# EAGLE design Xadow Audio v1.0 (EAGLE 6.4)
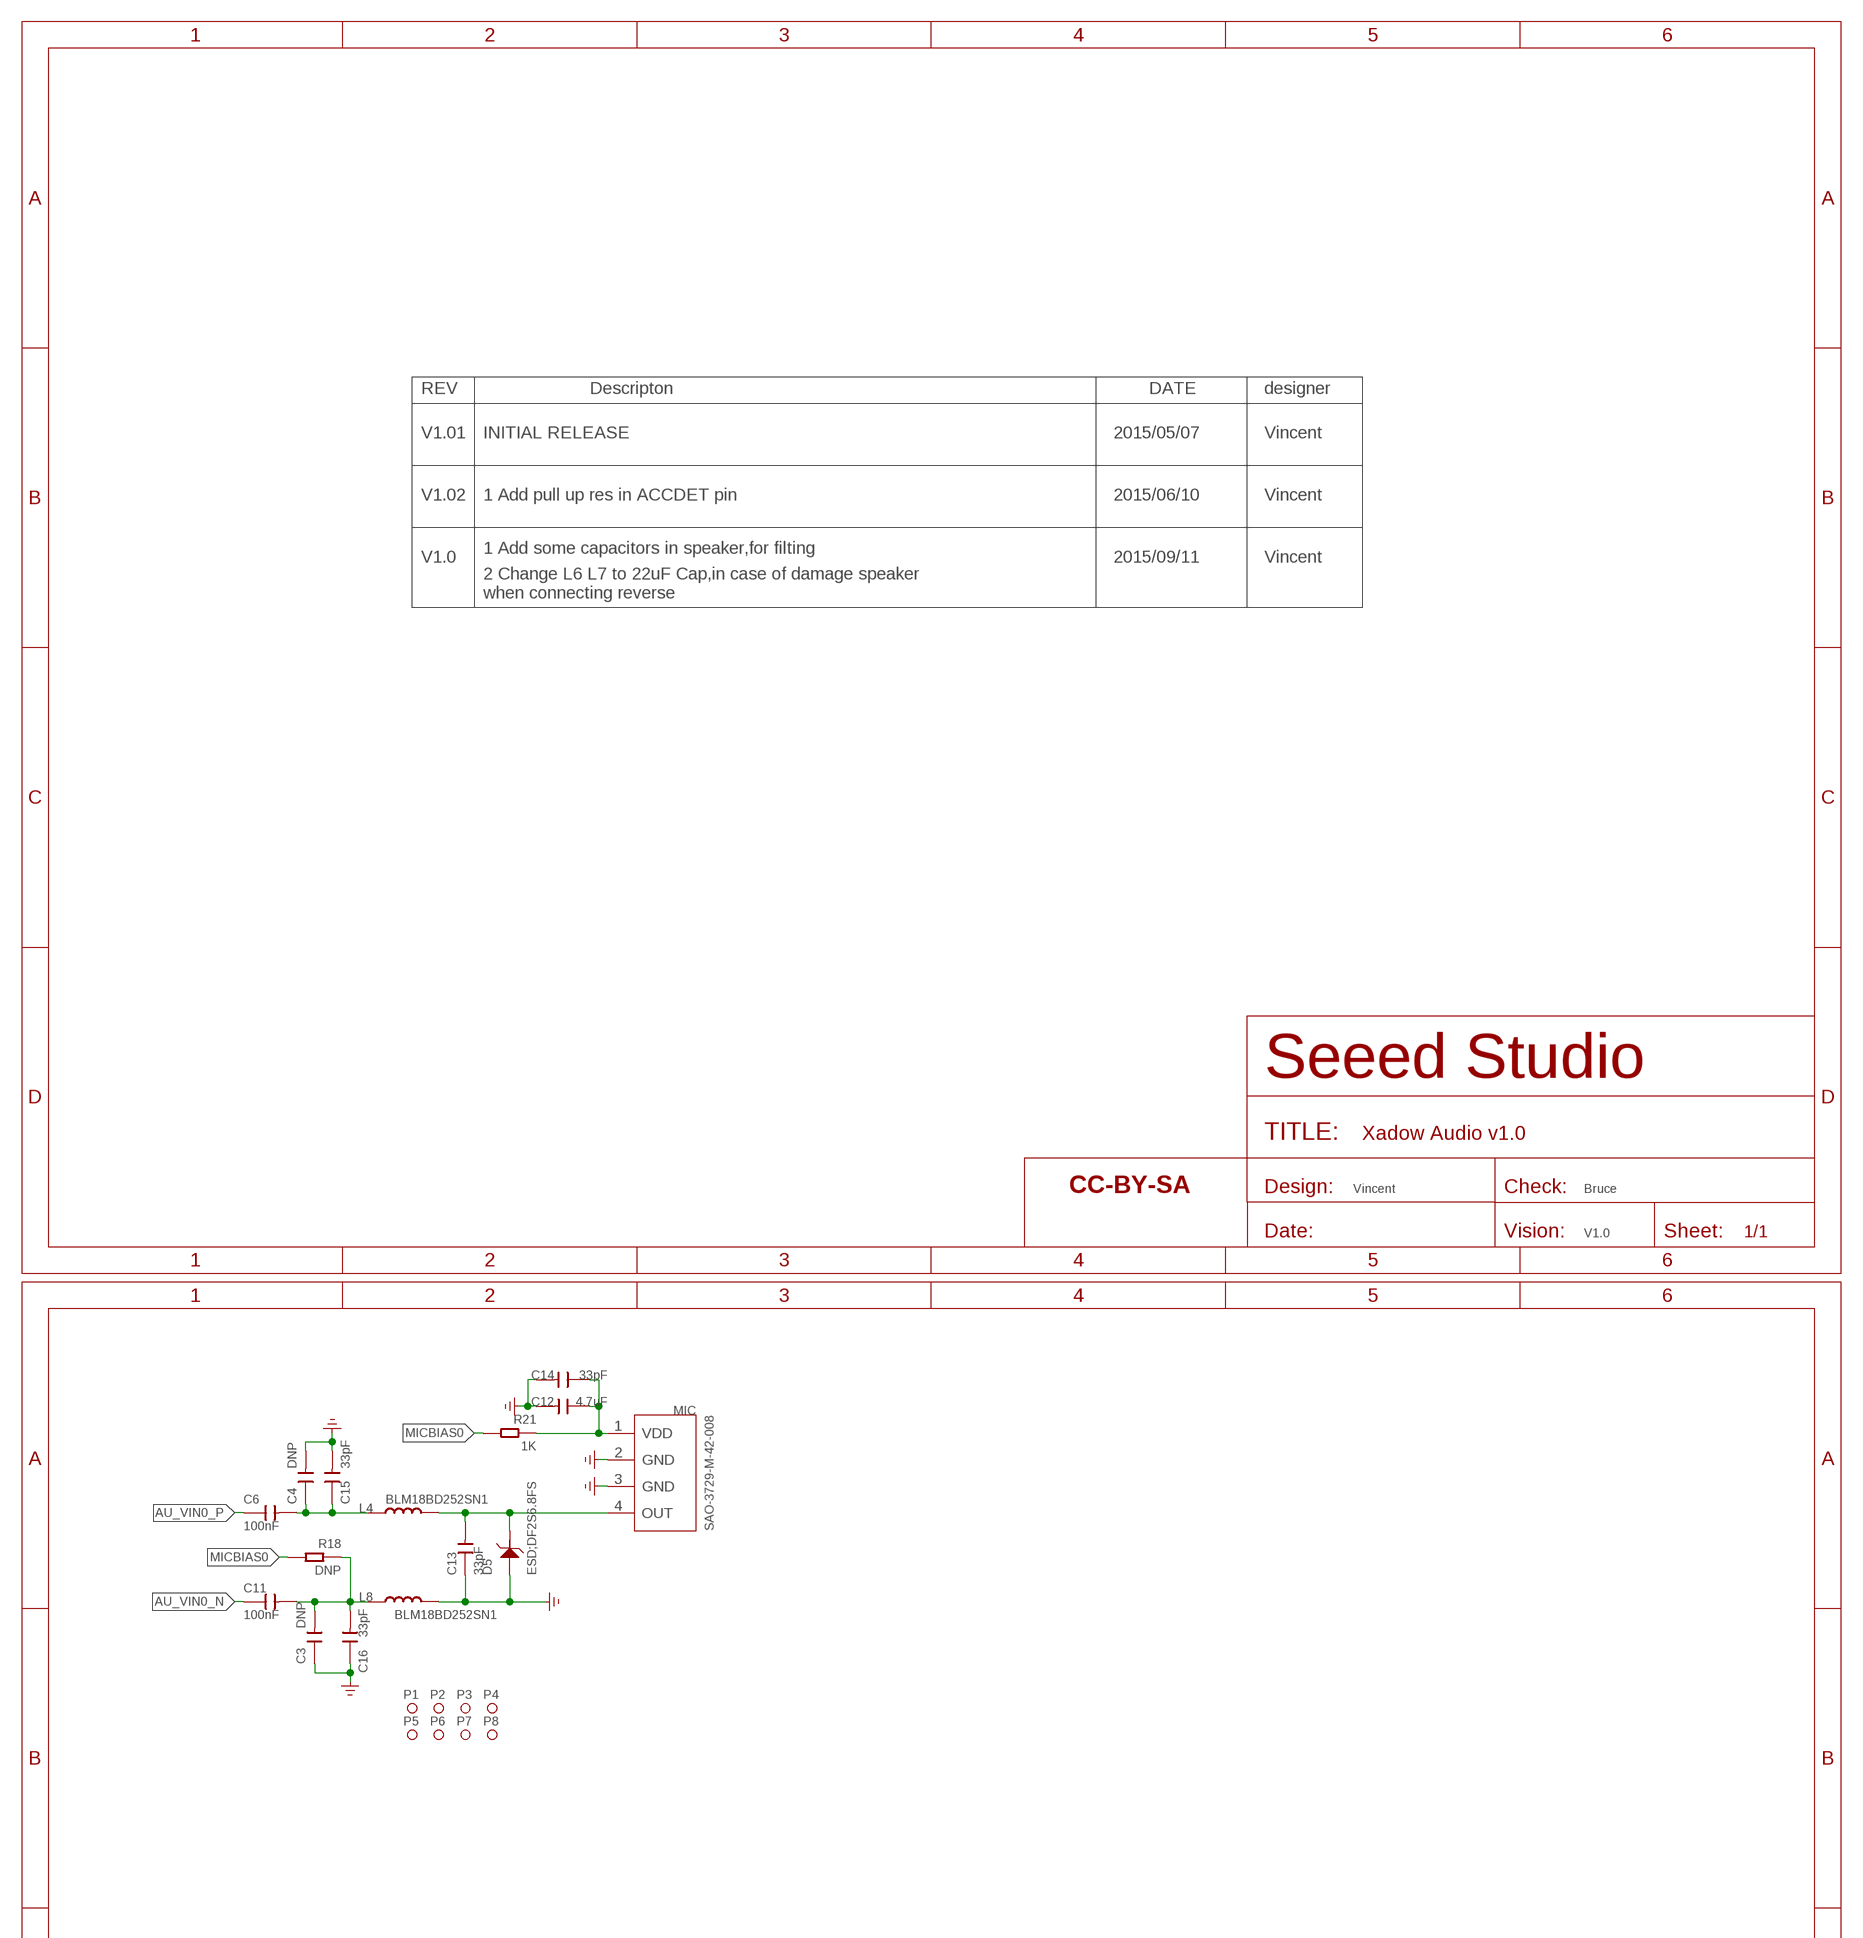
[diagram p0: schematic, sheet 1, part 1 of 2]
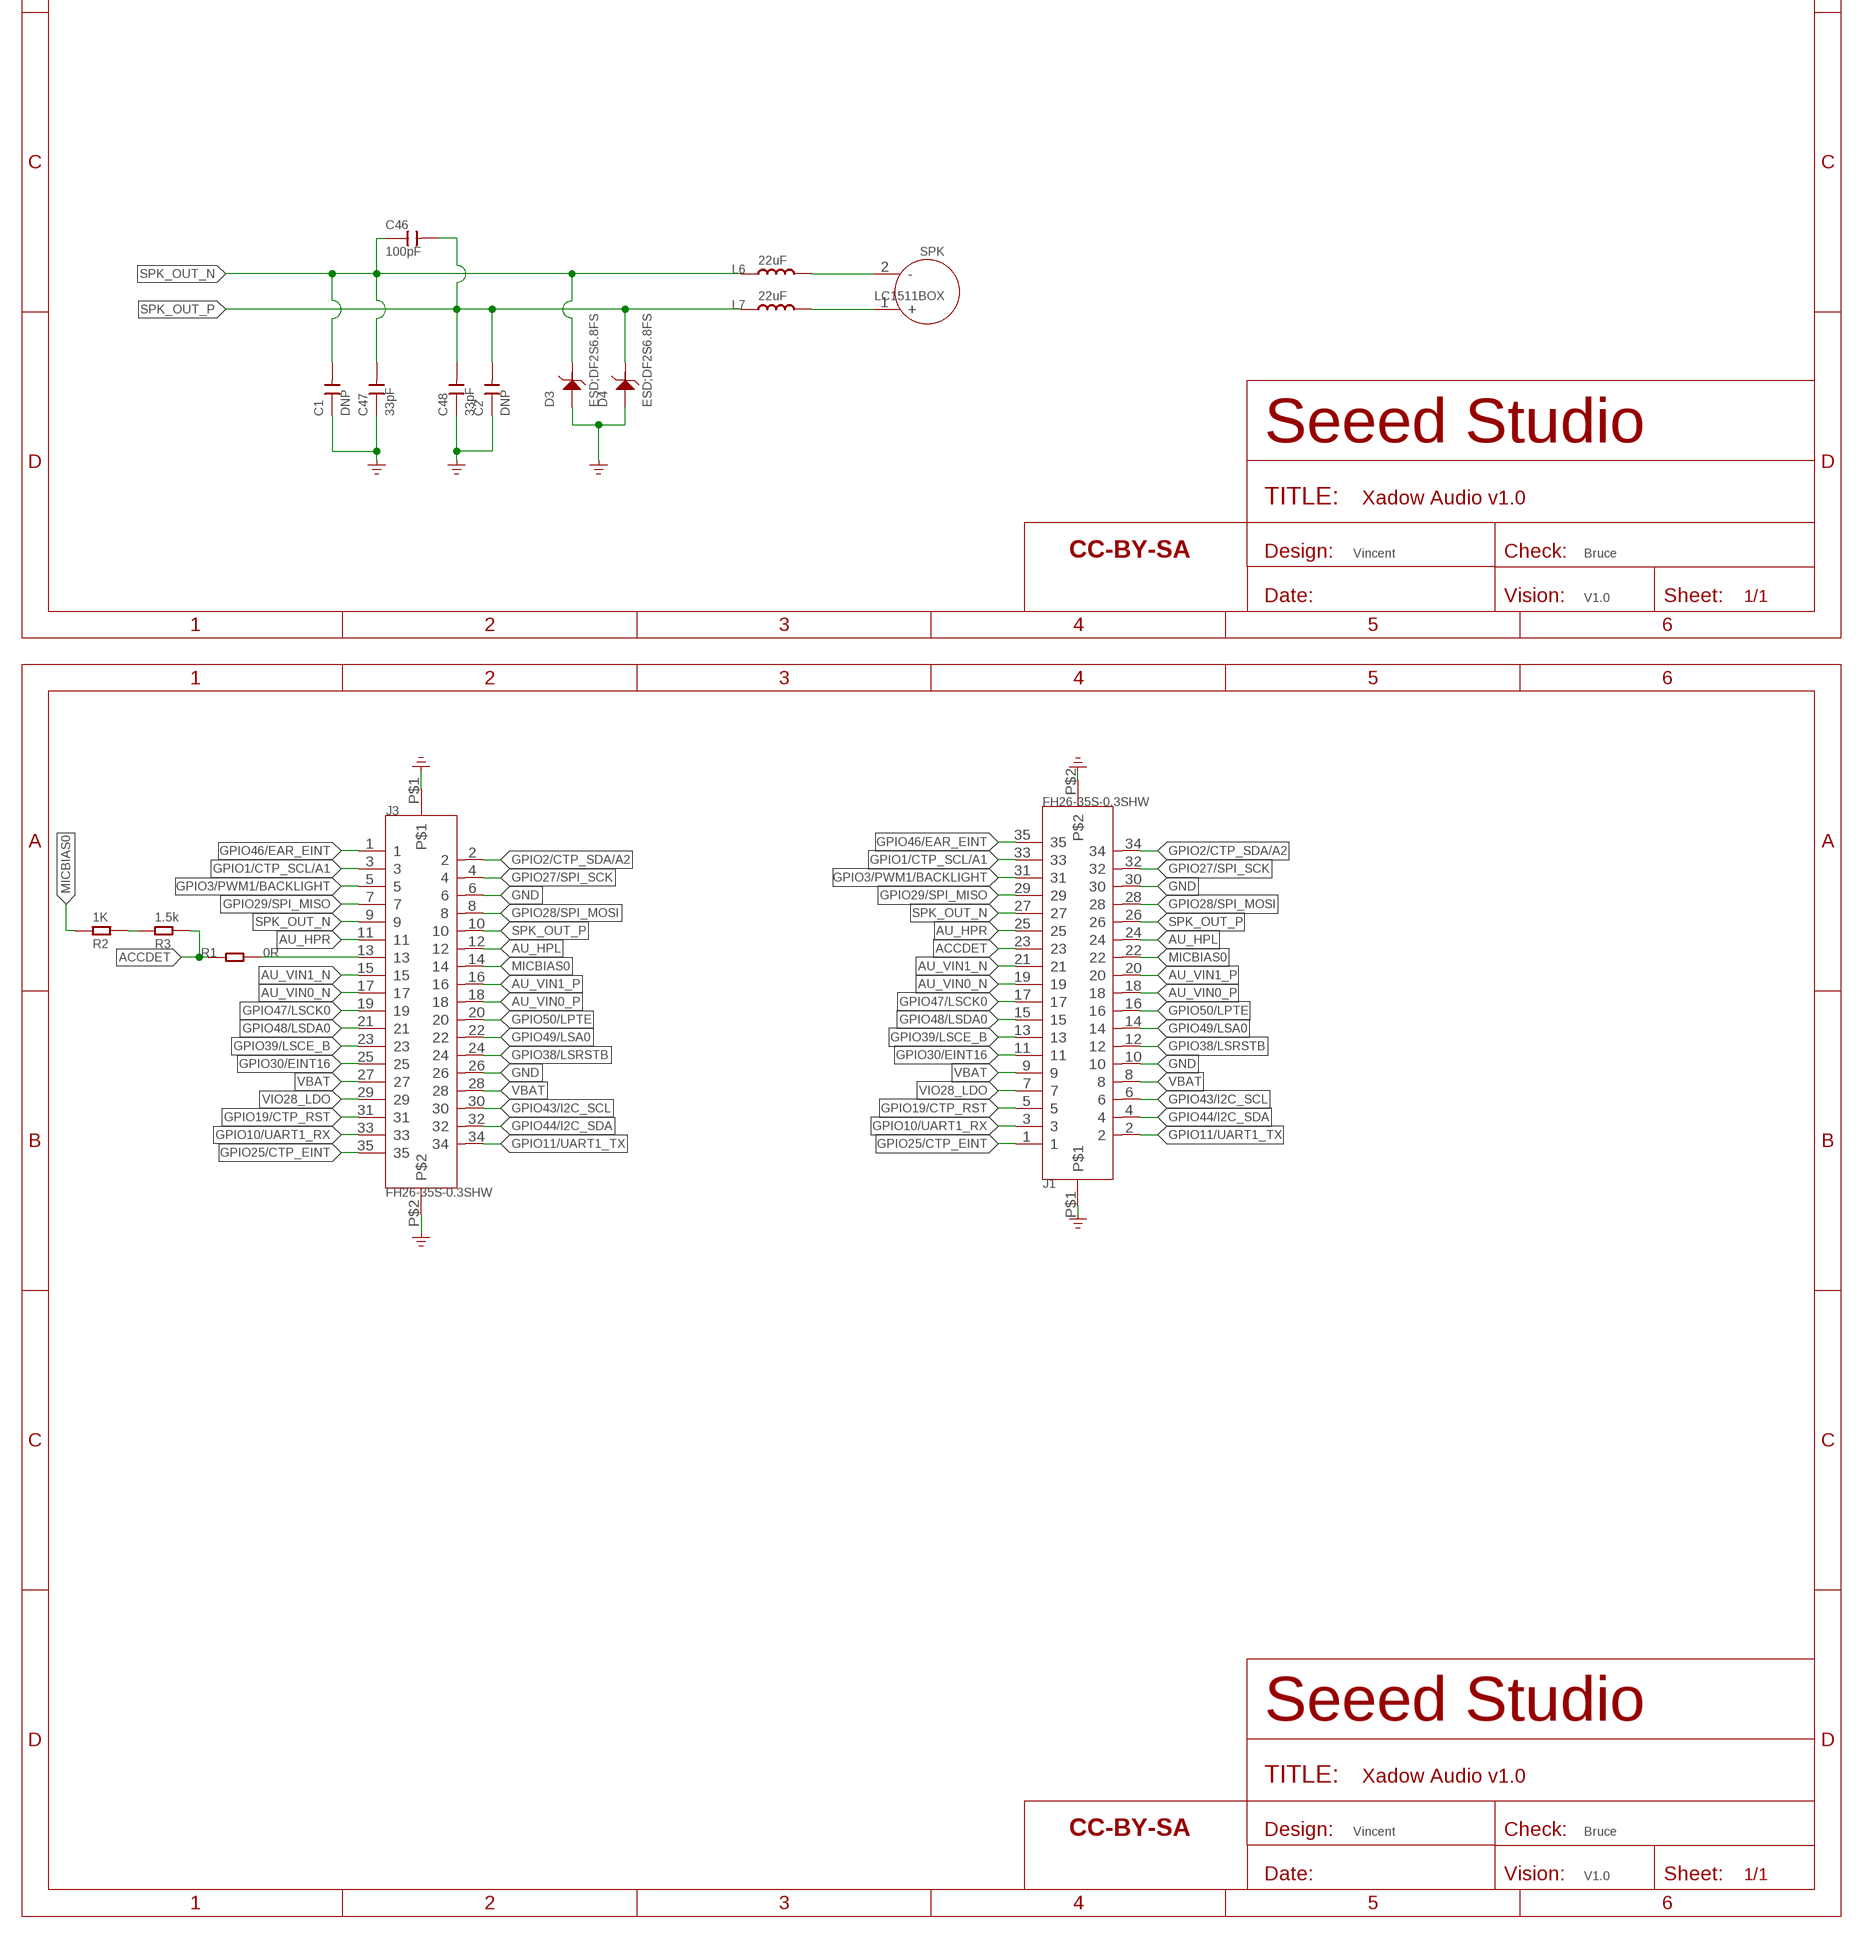
[diagram p1: schematic, sheet 1, part 2 of 2]

## Parts
C1  DNP  CAP-0402  [C0402]
C2  DNP  CAP-0402  [C0402]
C3  DNP  CAP-0402  [C0402]
C4  DNP  CAP-0402  [C0402]
C6  100nF  CAP-0402  [C0402]
C11  100nF  CAP-0402  [C0402]
C12  4.7uF  CAP-0402  [C0402]
C13  33pF  CAP-0402  [C0402]
C14  33pF  CAP-0402  [C0402]
C15  33pF  CAP-0402  [C0402]
C16  33pF  CAP-0402  [C0402]
C46  100pF  CAP-0402  [C0402]
C47  33pF  CAP-0402  [C0402]
C48  33pF  CAP-0402  [C0402]
D3  ESD;DF2S6.8FS  D-ESD-2P'DF2S6.8FS'  [SOD-923]
D4  ESD;DF2S6.8FS  D-ESD-2P'DF2S6.8FS'  [SOD-923]
D5  ESD;DF2S6.8FS  D-ESD-2P'DF2S6.8FS'  [SOD-923]
FR1  SEEEDSTUDIO-OPEN-SCH-FRAME  [SEEEDSTUDIO-PCB-FRAME]
J1  FH26-35S-0.3SHW  FPC-CONNECTER-35P(FH26W-35S-0.3SHW(10))  [FPC35-SMD-0.3(FH26W)]
J3  FH26-35S-0.3SHW  FPC-CONNECTER-35P(FH26W-35S-0.3SHW(10))  [FPC35-SMD-0.3(FH26W)]
L4  BLM18BD252SN1  L'0603'  [L0603]
L6  22uF  L'0603'  [L0603]
L7  22uF  L'0603'  [L0603]
L8  BLM18BD252SN1  L'0603'  [L0603]
MIC  SAO-3729-M-42-008  MIC-MSM421A3729H8-C  [MIC4-SMD-3.76X2.95MM]
P1  MARK-1.0'ANNULAR'  [ROUND-MARK-1.0]
P2  MARK-1.0'ANNULAR'  [ROUND-MARK-1.0]
P3  MARK-1.0'ANNULAR'  [ROUND-MARK-1.0]
P4  MARK-1.0'ANNULAR'  [ROUND-MARK-1.0]
P5  MARK-1.0'ANNULAR'  [ROUND-MARK-1.0]
P6  MARK-1.0'ANNULAR'  [ROUND-MARK-1.0]
P7  MARK-1.0'ANNULAR'  [ROUND-MARK-1.0]
P8  MARK-1.0'ANNULAR'  [ROUND-MARK-1.0]
R1  0R  RES-0402  [R0402]
R2  1K  RES-0402  [R0402]
R3  1.5k  RES-0402  [R0402]
R18  DNP  RES-0402  [R0402]
R21  1K  RES-0402  [R0402]
SPK  LC1511BOX  SPEAKER  [2P-SMD-SPEAKER]
U$1  SEEEDSTUDIO-OPEN-SCH-FRAME  [SEEEDSTUDIO-PCB-FRAME]
U$2  SEEEDSTUDIO-OPEN-SCH-FRAME  [SEEEDSTUDIO-PCB-FRAME]

## Nets
ACCDET: J1.23 R1.2 R3.2
AU_HPL: J1.24 J3.12
AU_HPR: J1.25 J3.11
AU_VIN0_N: C11.1 J1.19 J3.17
AU_VIN0_P: C6.1 J1.18 J3.18
AU_VIN1_N: J1.21 J3.15
AU_VIN1_P: J1.20 J3.16
GND: C1.1 C2.1 C3.1 C4.2 C12.2 C13.1 C14.2 C15.2 C16.1 C47.1 C48.1 D3.2 D4.2 D5.2 J1.10 J1.30 J1.P$1 J1.P$2 J3.6 J3.26 J3.P$1 J3.P$2 L8.2 MIC.2(GND) MIC.3(GND) ; supply symbol labelled GND_POWER
GPIO1/CTP_SCL/A1: J1.33 J3.3
GPIO2/CTP_SDA/A2: J1.34 J3.2
GPIO3/PWM1/BACKLIGHT: J1.31 J3.5
GPIO10/UART1_RX: J1.3 J3.33
GPIO11/UART1_TX: J1.2 J3.34
GPIO19/CTP_RST: J1.5 J3.31
GPIO25/CTP_EINT: J1.1 J3.35
GPIO27/SPI_SCK: J1.32 J3.4
GPIO28/SPI_MOSI: J1.28 J3.8
GPIO29/SPI_MISO: J1.29 J3.7
GPIO30/EINT16: J1.11 J3.25
GPIO38/LSRSTB: J1.12 J3.24
GPIO39/LSCE_B: J1.13 J3.23
GPIO43/I2C_SCL: J1.6 J3.30
GPIO44/I2C_SDA: J1.4 J3.32
GPIO46/EAR_EINT: J1.35 J3.1
GPIO47/LSCK0: J1.17 J3.19
GPIO48/LSDA0: J1.15 J3.21
GPIO49/LSA0: J1.14 J3.22
GPIO50/LPTE: J1.16 J3.20
MICBIAS0: J1.22 J3.14 R2.1 R18.2 R21.2
N$1: J3.13 R1.1
N$2: R2.2 R3.1
N$6: C4.1 C6.2 C15.1 L4.1
N$7: C3.2 C11.2 C16.2 L8.1 R18.1
N$8: C12.1 C14.1 MIC.1(VDD) R21.1
N$11: C13.2 D5.1 L4.2 MIC.4(OUT)
N$51: L6.2 SPK.2(-)
N$52: L7.2 SPK.1(+)
SPK_OUT_N: C1.2 C46.1 C47.2 D3.1 J1.27 J3.9 L6.1
SPK_OUT_P: C2.2 C46.2 C48.2 D4.1 J1.26 J3.10 L7.1
VBAT: J1.8 J1.9 J3.27 J3.28
VIO28_LDO: J1.7 J3.29

## Notes on the sheet
- REV | Descripton | DATE | designer
- V1.01 | INITIAL RELEASE | 2015/05/07 | Vincent
- V1.02 | 1 Add pull up res in ACCDET pin | 2015/06/10 | Vincent
- 1 Add some capacitors in speaker,for filting
- V1.0 | 2015/09/11 | Vincent
- 2 Change L6 L7 to 22uF Cap,in case of damage speaker 
  when connecting reverse
- Vincent | Bruce
- V1.0
- Vincent | Bruce
- V1.0
- Vincent | Bruce
- V1.0

## Library data of the parts
C1-C4 C6 C11-C16 C46-C48 = Discrete-new:CAP: Ceramic Capacitors
D3-D5 = Discrete-new:D-ESD-2P: SOD-923:304060009;SOD-123:304060001
FR1 U$1 U$2 = moudle-new:SEEEDSTUDIO-OPEN-SCH-FRAME
J1 J3 = template:FPC-CONNECTER-35P(FH26W-35S-0.3SHW(10))
L4 L6-L8 = Discrete:L*
MIC = template:MIC-MSM421A3729H8-C
P1-P8 = Discrete-new:MARK-1.0; PARTNO: DNP
R1-R3 R18 R21 = Discrete-new:RES
SPK = template:SPEAKER

## Board
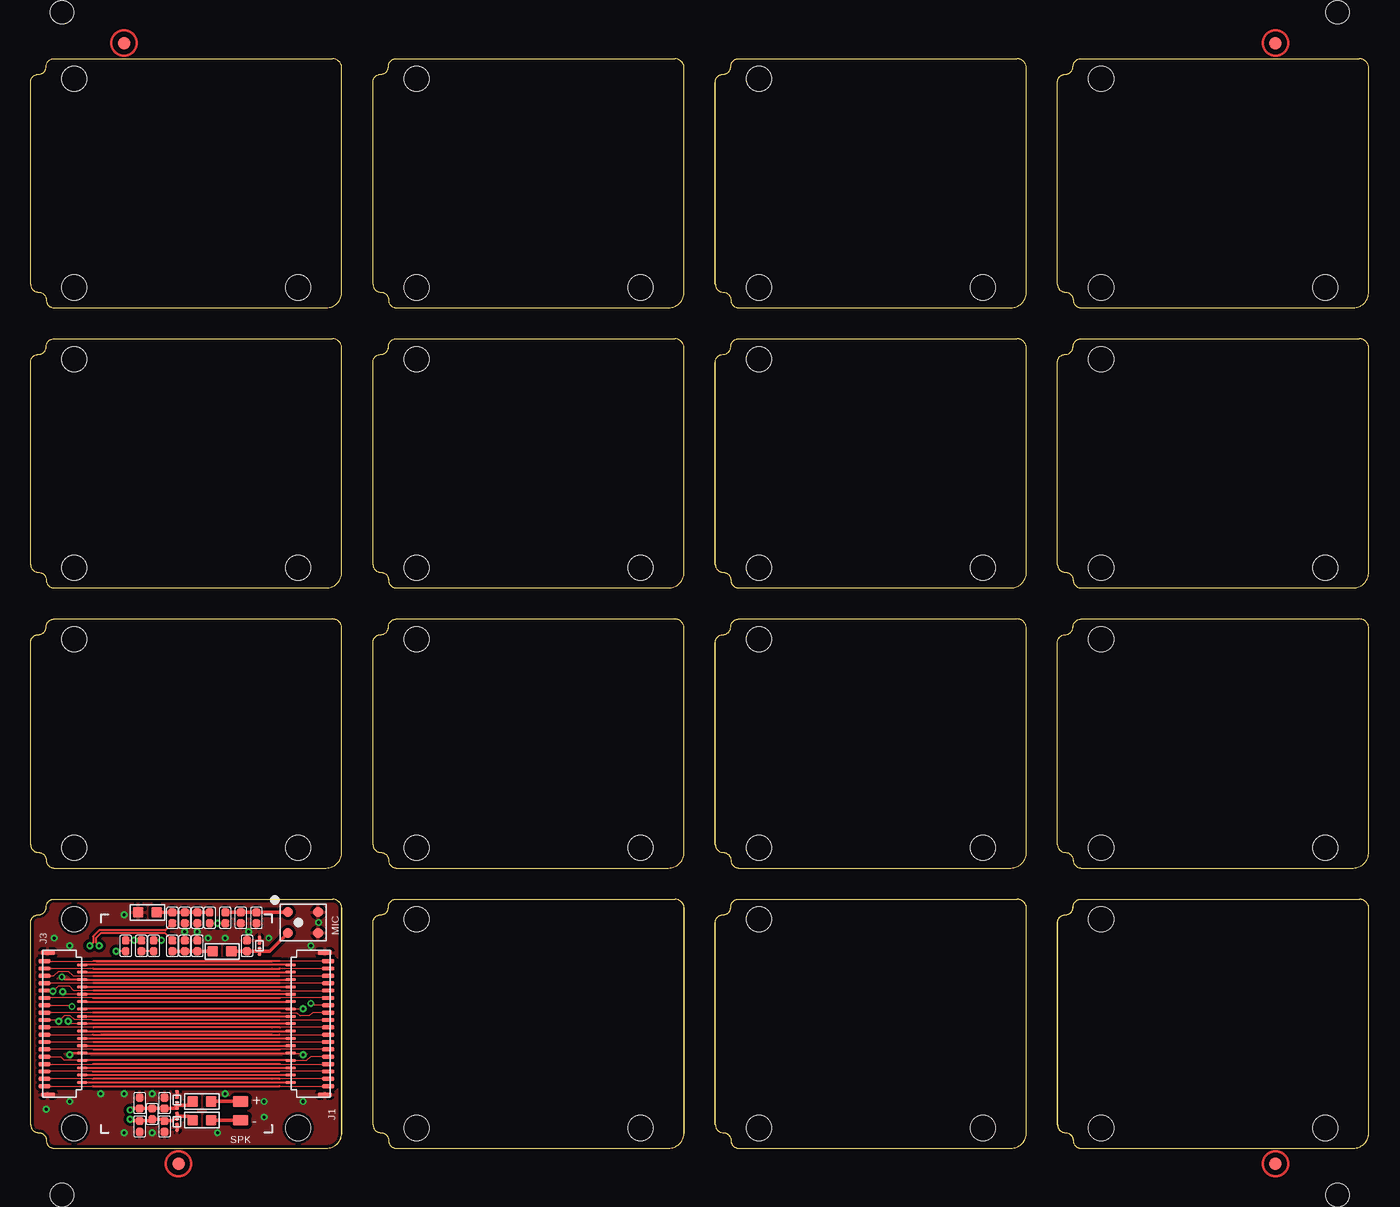
[diagram p2: board, top side]
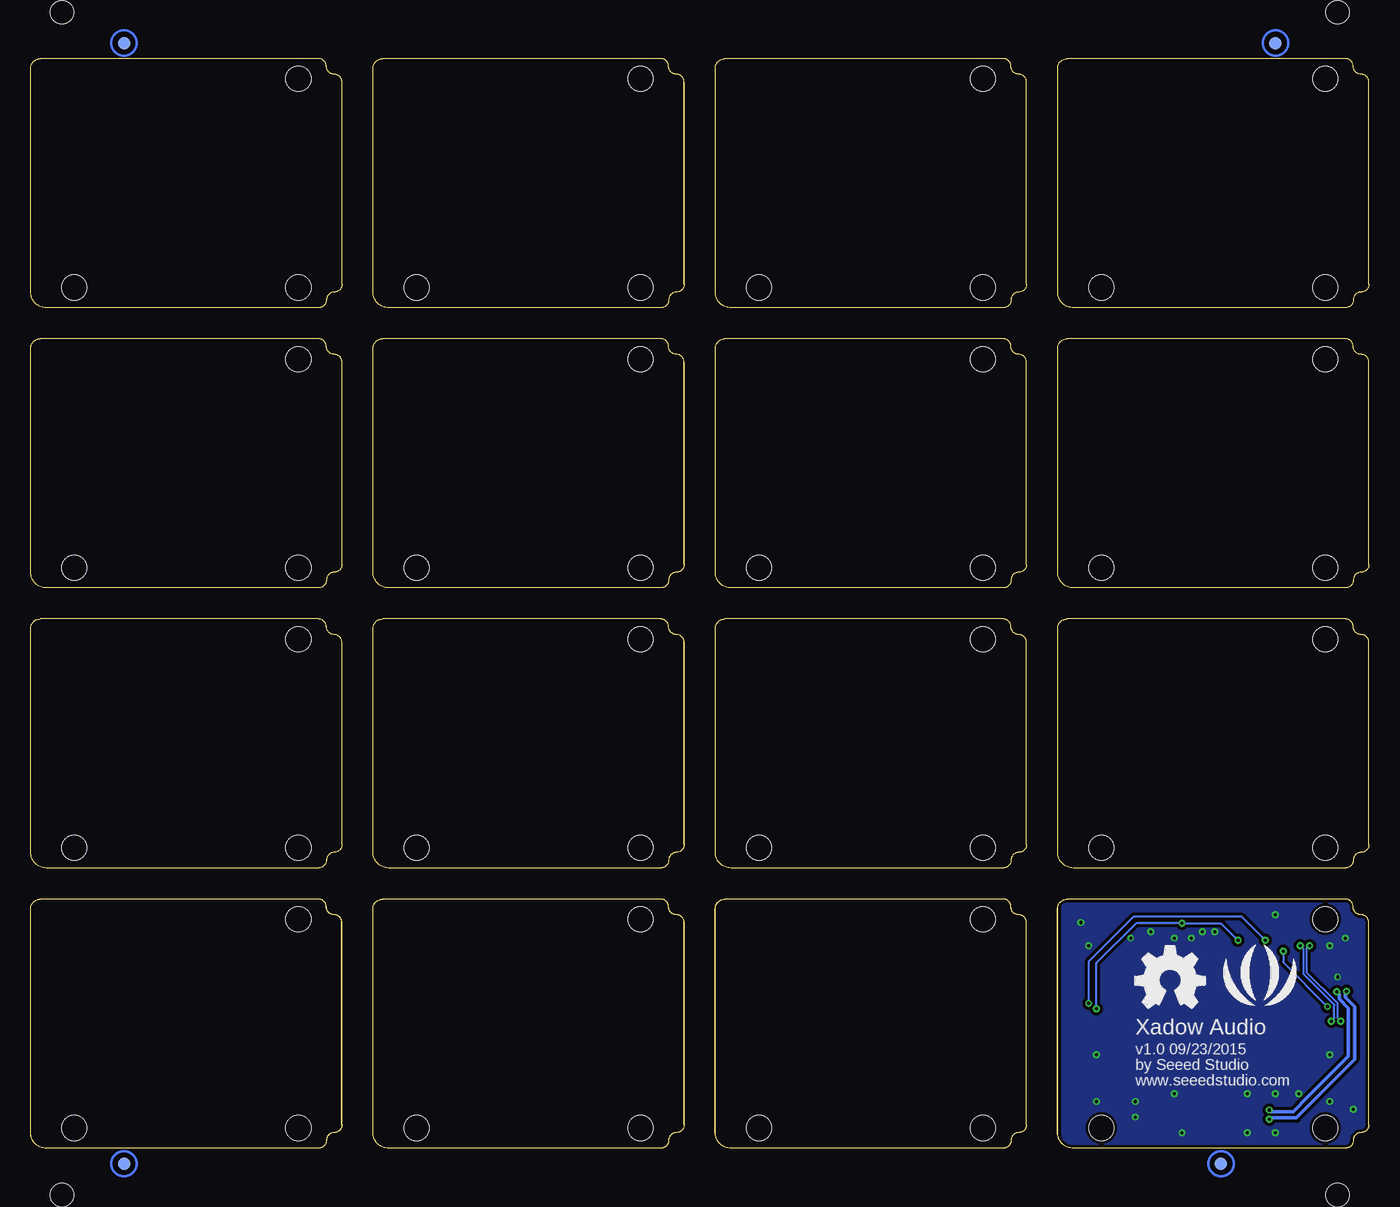
[diagram p3: board, bottom side, seen from below]

Size 109.23 x 88.9 mm. Coordinates in mm from the lower left corner, seen from the top.
Outline: 25.4,19.56 25.4,1.27 arc-90 24.13,0 1.9,0 arc-90 1.27,0.63 arc90 0.63,1.27 arc-90 0,1.91 0,18.41 arc-90 0.63,19.05 arc90 1.27,19.69 arc-90 1.9,20.32 24.64,20.32
Outline: 25.4,19.56 arc90 24.64,20.32
Outline: 25.4,19.56 arc90 24.64,20.32
Outline: 53.34,19.56 53.34,1.27 arc-90 52.07,0 29.84,0 arc-90 29.21,0.63 arc90 28.57,1.27 arc-90 27.94,1.91 27.94,18.41 arc-90 28.57,19.05 arc90 29.21,19.69 arc-90 29.84,20.32 52.58,20.32
Outline: 53.34,19.56 arc90 52.58,20.32
Outline: 53.34,19.56 arc90 52.58,20.32
Outline: 29.85,0 arc-90 29.21,0.63 arc90 28.58,1.27 arc-90 27.94,1.91 27.94,18.41 arc-90 28.58,19.05 arc90 29.21,19.69 arc-90 29.85,20.32 52.58,20.32 arc-90 53.34,19.56 53.34,1.27 arc-90 52.07,0
Outline: 81.28,19.56 81.28,1.27 arc-90 80.01,0 57.78,0 arc-90 57.15,0.63 arc90 56.51,1.27 arc-90 55.88,1.91 55.88,18.41 arc-90 56.51,19.05 arc90 57.15,19.69 arc-90 57.78,20.32 80.52,20.32
Outline: 81.28,19.56 arc90 80.52,20.32
Outline: 81.28,19.56 arc90 80.52,20.32
Outline: 109.22,19.56 109.22,1.27 arc-90 107.95,0 85.72,0 arc-90 85.09,0.63 arc90 84.45,1.27 arc-90 83.82,1.91 83.82,18.41 arc-90 84.45,19.05 arc90 85.09,19.69 arc-90 85.72,20.32 108.46,20.32
Outline: 109.22,19.56 arc90 108.46,20.32
Outline: 109.22,19.56 arc90 108.46,20.32
Outline: 25.4,42.42 25.4,24.13 arc-90 24.13,22.86 1.9,22.86 arc-90 1.27,23.49 arc90 0.63,24.13 arc-90 0,24.77 0,41.27 arc-90 0.63,41.91 arc90 1.27,42.54 arc-90 1.9,43.18 24.64,43.18
Outline: 25.4,42.42 arc90 24.64,43.18
Outline: 25.4,42.42 arc90 24.64,43.18
Outline: 53.34,42.42 53.34,24.13 arc-90 52.07,22.86 29.84,22.86 arc-90 29.21,23.49 arc90 28.57,24.13 arc-90 27.94,24.77 27.94,41.27 arc-90 28.57,41.91 arc90 29.21,42.54 arc-90 29.84,43.18 52.58,43.18
Outline: 53.34,42.42 arc90 52.58,43.18
Outline: 53.34,42.42 arc90 52.58,43.18
Outline: 81.28,42.42 81.28,24.13 arc-90 80.01,22.86 57.78,22.86 arc-90 57.15,23.49 arc90 56.51,24.13 arc-90 55.88,24.77 55.88,41.27 arc-90 56.51,41.91 arc90 57.15,42.54 arc-90 57.78,43.18 80.52,43.18
Outline: 81.28,42.42 arc90 80.52,43.18
Outline: 81.28,42.42 arc90 80.52,43.18
Outline: 109.22,42.42 109.22,24.13 arc-90 107.95,22.86 85.72,22.86 arc-90 85.09,23.49 arc90 84.45,24.13 arc-90 83.82,24.77 83.82,41.27 arc-90 84.45,41.91 arc90 85.09,42.54 arc-90 85.72,43.18 108.46,43.18
Outline: 109.22,42.42 arc90 108.46,43.18
Outline: 109.22,42.42 arc90 108.46,43.18
Outline: 25.4,65.28 25.4,46.99 arc-90 24.13,45.72 1.9,45.72 arc-90 1.27,46.35 arc90 0.63,46.99 arc-90 0,47.63 0,64.13 arc-90 0.63,64.77 arc90 1.27,65.41 arc-90 1.9,66.04 24.64,66.04
Outline: 25.4,65.28 arc90 24.64,66.04
Outline: 25.4,65.28 arc90 24.64,66.04
Outline: 53.34,65.28 53.34,46.99 arc-90 52.07,45.72 29.84,45.72 arc-90 29.21,46.35 arc90 28.57,46.99 arc-90 27.94,47.63 27.94,64.13 arc-90 28.57,64.77 arc90 29.21,65.41 arc-90 29.84,66.04 52.58,66.04
Outline: 53.34,65.28 arc90 52.58,66.04
Outline: 53.34,65.28 arc90 52.58,66.04
Outline: 81.28,65.28 81.28,46.99 arc-90 80.01,45.72 57.78,45.72 arc-90 57.15,46.35 arc90 56.51,46.99 arc-90 55.88,47.63 55.88,64.13 arc-90 56.51,64.77 arc90 57.15,65.41 arc-90 57.78,66.04 80.52,66.04
Outline: 81.28,65.28 arc90 80.52,66.04
Outline: 81.28,65.28 arc90 80.52,66.04
Outline: 109.22,65.28 109.22,46.99 arc-90 107.95,45.72 85.72,45.72 arc-90 85.09,46.35 arc90 84.45,46.99 arc-90 83.82,47.63 83.82,64.13 arc-90 84.45,64.77 arc90 85.09,65.41 arc-90 85.72,66.04 108.46,66.04
Outline: 109.22,65.28 arc90 108.46,66.04
Outline: 109.22,65.28 arc90 108.46,66.04
Outline: 25.4,88.14 25.4,69.85 arc-90 24.13,68.58 1.9,68.58 arc-90 1.27,69.22 arc90 0.63,69.85 arc-90 0,70.49 0,87 arc-90 0.63,87.63 arc90 1.27,88.27 arc-90 1.9,88.9 24.64,88.9
Outline: 25.4,88.14 arc90 24.64,88.9
Outline: 25.4,88.14 arc90 24.64,88.9
Outline: 53.34,88.14 53.34,69.85 arc-90 52.07,68.58 29.84,68.58 arc-90 29.21,69.22 arc90 28.57,69.85 arc-90 27.94,70.49 27.94,87 arc-90 28.57,87.63 arc90 29.21,88.27 arc-90 29.84,88.9 52.58,88.9
Outline: 53.34,88.14 arc90 52.58,88.9
Outline: 53.34,88.14 arc90 52.58,88.9
Outline: 81.28,88.14 81.28,69.85 arc-90 80.01,68.58 57.78,68.58 arc-90 57.15,69.22 arc90 56.51,69.85 arc-90 55.88,70.49 55.88,87 arc-90 56.51,87.63 arc90 57.15,88.27 arc-90 57.78,88.9 80.52,88.9
Outline: 81.28,88.14 arc90 80.52,88.9
Outline: 81.28,88.14 arc90 80.52,88.9
Outline: 109.22,88.14 109.22,69.85 arc-90 107.95,68.58 85.72,68.58 arc-90 85.09,69.22 arc90 84.45,69.85 arc-90 83.82,70.49 83.82,87 arc-90 84.45,87.63 arc90 85.09,88.27 arc-90 85.72,88.9 108.46,88.9
Outline: 109.22,88.14 arc90 108.46,88.9
Outline: 109.22,88.14 arc90 108.46,88.9
Outline: 1.28,0.63 arc90 1.92,0 24.14,0 arc90 25.41,1.27 25.41,19.56 arc90 24.65,20.32 1.92,20.32 arc90 1.28,19.69 arc-90 0.65,19.05 arc90 0.01,18.41 0.01,1.91 arc90 0.65,1.27 arc-90 1.28,0.63
Outline: 29.22,0.63 arc90 29.86,0 52.08,0 arc90 53.35,1.27 53.35,19.56 arc90 52.59,20.32 29.86,20.32 arc90 29.22,19.69 arc-90 28.59,19.05 arc90 27.95,18.41 27.95,1.91 arc90 28.59,1.27 arc-90 29.22,0.63
Outline: 57.16,0.63 arc90 57.8,0 80.02,0 arc90 81.29,1.27 81.29,19.56 arc90 80.53,20.32 57.8,20.32 arc90 57.16,19.69 arc-90 56.53,19.05 arc90 55.89,18.41 55.89,1.91 arc90 56.53,1.27 arc-90 57.16,0.63
Outline: 85.1,0.63 arc90 85.74,0 107.96,0 arc90 109.23,1.27 109.23,19.56 arc90 108.47,20.32 85.74,20.32 arc90 85.1,19.69 arc-90 84.47,19.05 arc90 83.83,18.41 83.83,1.91 arc90 84.47,1.27 arc-90 85.1,0.63
Outline: 1.27,0.63 arc90 1.91,0 24.13,0 arc90 25.4,1.27 25.4,19.56 arc90 24.64,20.32 1.91,20.32 arc90 1.27,19.69 arc-90 0.64,19.05 arc90 0,18.41 0,1.91 arc90 0.64,1.27 arc-90 1.27,0.63
Outline: 57.15,0.63 arc90 57.79,0 80.01,0 arc90 81.28,1.27 81.28,19.56 arc90 80.52,20.32 57.79,20.32 arc90 57.15,19.69 arc-90 56.52,19.05 arc90 55.88,18.41 55.88,1.91 arc90 56.52,1.27 arc-90 57.15,0.63
Outline: 85.09,0.63 arc90 85.73,0 107.95,0 arc90 109.22,1.27 109.22,19.56 arc90 108.46,20.32 85.73,20.32 arc90 85.09,19.69 arc-90 84.46,19.05 arc90 83.82,18.41 83.82,1.91 arc90 84.46,1.27 arc-90 85.09,0.63
Outline: 1.27,23.49 arc90 1.91,22.86 24.13,22.86 arc90 25.4,24.13 25.4,42.42 arc90 24.64,43.18 1.91,43.18 arc90 1.27,42.54 arc-90 0.64,41.91 arc90 0,41.27 0,24.77 arc90 0.64,24.13 arc-90 1.27,23.49
Outline: 29.21,23.49 arc90 29.85,22.86 52.07,22.86 arc90 53.34,24.13 53.34,42.42 arc90 52.58,43.18 29.85,43.18 arc90 29.21,42.54 arc-90 28.58,41.91 arc90 27.94,41.27 27.94,24.77 arc90 28.58,24.13 arc-90 29.21,23.49
Outline: 57.15,23.49 arc90 57.79,22.86 80.01,22.86 arc90 81.28,24.13 81.28,42.42 arc90 80.52,43.18 57.79,43.18 arc90 57.15,42.54 arc-90 56.52,41.91 arc90 55.88,41.27 55.88,24.77 arc90 56.52,24.13 arc-90 57.15,23.49
Outline: 85.09,23.49 arc90 85.73,22.86 107.95,22.86 arc90 109.22,24.13 109.22,42.42 arc90 108.46,43.18 85.73,43.18 arc90 85.09,42.54 arc-90 84.46,41.91 arc90 83.82,41.27 83.82,24.77 arc90 84.46,24.13 arc-90 85.09,23.49
Outline: 1.27,46.35 arc90 1.91,45.72 24.13,45.72 arc90 25.4,46.99 25.4,65.28 arc90 24.64,66.04 1.91,66.04 arc90 1.27,65.41 arc-90 0.64,64.77 arc90 0,64.13 0,47.63 arc90 0.64,46.99 arc-90 1.27,46.35
Outline: 29.21,46.35 arc90 29.85,45.72 52.07,45.72 arc90 53.34,46.99 53.34,65.28 arc90 52.58,66.04 29.85,66.04 arc90 29.21,65.41 arc-90 28.58,64.77 arc90 27.94,64.13 27.94,47.63 arc90 28.58,46.99 arc-90 29.21,46.35
Outline: 57.15,46.35 arc90 57.79,45.72 80.01,45.72 arc90 81.28,46.99 81.28,65.28 arc90 80.52,66.04 57.79,66.04 arc90 57.15,65.41 arc-90 56.52,64.77 arc90 55.88,64.13 55.88,47.63 arc90 56.52,46.99 arc-90 57.15,46.35
Outline: 85.09,46.35 arc90 85.73,45.72 107.95,45.72 arc90 109.22,46.99 109.22,65.28 arc90 108.46,66.04 85.73,66.04 arc90 85.09,65.41 arc-90 84.46,64.77 arc90 83.82,64.13 83.82,47.63 arc90 84.46,46.99 arc-90 85.09,46.35
Outline: 1.27,69.22 arc90 1.91,68.58 24.13,68.58 arc90 25.4,69.85 25.4,88.14 arc90 24.64,88.9 1.91,88.9 arc90 1.27,88.27 arc-90 0.64,87.63 arc90 0,87 0,70.49 arc90 0.64,69.85 arc-90 1.27,69.22
Outline: 29.21,69.22 arc90 29.85,68.58 52.07,68.58 arc90 53.34,69.85 53.34,88.14 arc90 52.58,88.9 29.85,88.9 arc90 29.21,88.27 arc-90 28.58,87.63 arc90 27.94,87 27.94,70.49 arc90 28.58,69.85 arc-90 29.21,69.22
Outline: 57.15,69.22 arc90 57.79,68.58 80.01,68.58 arc90 81.28,69.85 81.28,88.14 arc90 80.52,88.9 57.79,88.9 arc90 57.15,88.27 arc-90 56.52,87.63 arc90 55.88,87 55.88,70.49 arc90 56.52,69.85 arc-90 57.15,69.22
Outline: 85.09,69.22 arc90 85.73,68.58 107.95,68.58 arc90 109.22,69.85 109.22,88.14 arc90 108.46,88.9 85.73,88.9 arc90 85.09,88.27 arc-90 84.46,87.63 arc90 83.82,87 83.82,70.49 arc90 84.46,69.85 arc-90 85.09,69.22
Copper layers (1*16): Top 0.035mm / dielectric 1.5mm / Bottom 0.035mm
Design rules "SeeedStudio_2layer_DRU_no_angle_20140221 *": minimum track width 4mil, minimum drill 10mil, track to track 4mil, track to pad 4mil, pad to pad 4mil, via to via 4mil, smd to smd 0mil, copper to edge 10mil, drill to drill 10mil, minimum pad ring 10mil, minimum via ring 6mil, stop-mask expansion 2mil, vias tented up to drill 25mil, thermal gap 10mil
Holes 2.03 mm at 3.57,1.65 3.57,18.67 59.45,1.65 77.74,1.65 21.85,1.65 49.79,1.65 31.5,18.67 31.5,1.65 21.85,24.51 3.56,41.53 3.56,24.51 49.79,24.51 31.5,41.53 31.5,24.51 59.44,18.67 105.67,1.65 87.38,18.67 87.38,1.65 77.73,24.51 59.44,41.53 59.44,24.51 105.67,24.51 87.38,41.53 87.38,24.51 21.85,47.37 3.56,64.39 3.56,47.37 49.79,47.37 31.5,64.39 31.5,47.37 21.85,70.23 3.56,87.25 3.56,70.23 49.79,70.23 31.5,87.25 31.5,70.23 77.73,47.37 59.44,64.39 59.44,47.37 105.67,47.37 87.38,64.39 87.38,47.37 77.73,70.23 59.44,87.25 59.44,70.23 105.67,70.23 87.38,87.25 87.38,70.23
Holes 1.91 mm at 2.54,-3.81 106.68,-3.81 106.68,92.71 2.54,92.71

### Footprints (pad centres in the part's own frame; a part is rotated, then mirrored left to right if it is on the bottom)
C0402 = smd 0.635 x 0.635: 1 0,0.445; 2 0,-0.445
SOD-923 = smd 0.7 x 0.3: 1 -0.45,0; 2 0.45,0
FPC35-SMD-0.3(FH26W) = smd 0.3 x 1: 1 -5.1,-1.551; 3 -4.5,-1.551; 5 -3.9,-1.551; 7 -3.3,-1.551; 9 -2.7,-1.551; 11 -2.1,-1.551; 13 -1.5,-1.551; 15 -0.9,-1.551; 17 -0.3,-1.551; 19 0.3,-1.551; 21 0.9,-1.551; 23 1.5,-1.551; 25 2.1,-1.551; 27 2.7,-1.551; 29 3.3,-1.551; 31 3.9,-1.551; 33 4.5,-1.551; 35 5.1,-1.551 | smd 0.254 x 0.851: 2 -4.8,1.524; 4 -4.2,1.524; 6 -3.6,1.524; 8 -3,1.524; 10 -2.4,1.524; 12 -1.8,1.524; 14 -1.2,1.524; 16 -0.6,1.524; 18 0,1.524; 20 0.6,1.524; 22 1.2,1.524; 24 1.8,1.524; 26 2.4,1.524; 28 3,1.524; 30 3.6,1.524; 32 4.2,1.524; 34 4.8,1.524 | smd 0.4 x 1.15: P$1 5.8,-1.276; P$2 -5.8,-1.276
L0603 = smd 0.889 x 0.889: 1 -0.762,0; 2 0.762,0
MIC4-SMD-3.76X2.95MM = smd 0.8 x 0.8: 1 0.85,1.23; 2 0.85,-1.23; 3 -0.85,-1.23; 4 -0.85,1.23
ROUND-MARK-1.0 = smd 1.016 x 1.016: P$1 0,0
R0402 = smd 0.635 x 0.635: 1 0,0.445; 2 0,-0.445
2P-SMD-SPEAKER = smd 1.27 x 0.889: 1 0,0.762; 2 0,-0.762

### Placement (x,y rotation side)
C1  8.9,1.78 180 top
C2  10.93,3.68 0 top
C3  12.59,18.8 180 top
C4  12.59,16.51 180 top
C6  11.57,16.51 0 top
C11  11.57,18.8 180 top
C12  17.16,18.8 0 top
C13  17.67,16.51 0 top
C14  18.43,18.8 0 top
C15  13.6,16.51 180 top
C16  13.6,18.8 180 top
C46  9.92,2.79 180 top
C47  10.93,1.78 180 top
C48  8.9,3.68 0 top
D3  11.95,2.16 270 top
D4  11.95,3.94 90 top
D5  18.68,16.51 90 top
FR1  -14.47,-27.05 0 top  (outside the outline)
J1  22.75,10.16 90 top
J3  2.68,10.16 270 top
L4  15.63,16.07 0 top
L6  13.98,2.29 0 top
L7  13.98,3.81 0 top
L8  9.54,19.24 180 top
MIC  22.24,18.41 90 top
P1  101.61,90.17 90 top
P2  101.61,90.17 270 bottom
P3  7.63,90.17 90 top
P4  7.63,90.17 270 bottom
P5  101.61,-1.27 90 top
P6  101.61,-1.27 270 bottom
P7  12.08,-1.27 90 top
P8  12.08,-1.27 270 bottom
R1  7.76,16.51 180 top
R2  10.05,16.51 0 top
R3  9.03,16.51 180 top
R18  14.62,18.8 0 top
R21  15.89,18.8 0 top
SPK  17.16,3.05 0 top
U$1  -13.96,-20.45 0 top  (outside the outline)
U$2  -13.83,-12.32 0 top  (outside the outline)
U$3  [OSHW_FILLX200_NOTEXT]  19.06,11.43 0 bottom
U$4  [SEEED-SILK-280*268MIL]  8.9,13.34 0 bottom

### Tracks (layer width: path | path; a pad name or v marks a point on that pad's centre or on a via)
ACCDET  (via drill 0.25 pad 0.51)
  Top 0.102: v22.87,11.81 23.02,11.66 J1.23
  Top 0.152: R1.2 v8.46,16.95 R3.2
  Bottom 0.152: v22.87,11.81 22.87,15.24 19.19,18.92 10.43,18.92 v8.46,16.95
AU_HPL
  Top 0.152: J3.12 J1.24
AU_HPR
  Top 0.102: J1.25 19.7,12.26 | 19.7,12.26 5.08,12.26 1,12.26 J3.11
  Top 0.152: 19.7,12.26 | 5.08,12.26 20.33,12.26
AU_VIN0_N  (via drill 0.25 pad 0.51)
  Top 0.102: 5.73,10.46 J1.19 | 5.73,10.46 5.08,10.46 3.59,10.46 3.25,10.8 2.74,10.8 v2.3,10.35 2.19,10.46 J3.17 | J1.19
  Top 0.152: 5.73,10.46 | v4.84,16.51 5.09,16.76 5.09,17.29 5.59,17.78 11,17.78 C11.1 | 5.08,10.46 20.31,10.46
  Bottom 0.152: v4.84,16.51 5.09,16.26 5.09,14.35 2.55,11.81 2.55,10.61 v2.3,10.35
AU_VIN0_P  (via drill 0.25 pad 0.51)
  Top 0.102: J3.18 3.25,10.16 v3.06,10.35
  Top 0.152: J1.18 J3.18 | v5.6,16.51 5.35,16.76 5.35,17.17 5.7,17.53 11,17.53 C6.1
  Bottom 0.152: v5.6,16.51 5.35,16.26 5.35,14.24 2.81,11.7 2.81,10.61 v3.06,10.35
AU_VIN1_N
  Top 0.102: 19.7,11.06 1.16,11.06 | 1.16,11.06 1,11.06 | 19.7,11.06 20.34,11.06 21.72,11.06 21.98,10.8 22.75,10.8 23.01,11.06 J1.21 | J3.15 1.15,11.06 1.16,11.06
  Top 0.152: 19.7,11.06 | 20.34,11.06 5.1,11.06
AU_VIN1_P
  Top 0.152: J3.16 J1.20
GND  (via drill 0.25 pad 0.51)
  Top 0.102: 21.46,7.76 J1.10 22.1,7.76 v22.24,7.62 | 3.33,7.76 v3.19,7.62 | 2.76,13.76 v2.55,13.97
  Top 0.152: J1.30 J3.6 2.76,13.76 | J1.10 J3.26 3.33,7.76
  other vias: 7.63,19.05 7.63,4.45 7.63,1.27 15.25,1.27 15.89,4.45 19.06,2.54 19.06,3.81 22.87,16.51 15.89,17.15 19.44,17.15 1.92,17.15 3.19,16.51 1.28,3.18 22.24,3.81 3.19,3.81 5.73,4.45 23.51,18.41 14.49,17.15 17.79,17.65 12.59,17.65 13.6,17.65 9.92,4.45 9.92,1.27
  pour Bottom (isolate 0.254): 0.01,0 25.41,0 25.41,20.32 0.01,20.32
  pour Top (isolate 0.254): 0.01,0 25.41,0 25.41,20.32 0.01,20.32
GPIO1/CTP_SCL/A1
  Top 0.102: J1.33 19.7,14.66 | 19.7,14.66 5.09,14.66 J3.3 | 1,14.66 J3.3 | J3.3
  Top 0.152: 19.7,14.66 | 5.09,14.66 20.32,14.66 20.33,14.67
GPIO2/CTP_SDA/A2
  Top 0.152: J1.34 J3.2
GPIO3/PWM1/BACKLIGHT
  Top 0.102: J3.5 1.88,14.06 2.23,14.41 3.12,14.41 3.48,14.06 5.09,14.06 J1.31
  Top 0.152: 5.09,14.06 20.31,14.06
GPIO10/UART1_RX
  Top 0.102: J1.3 20.32,5.66 19.7,5.66 | 19.7,5.66 J3.33
  Top 0.152: 19.7,5.66 | 20.32,5.66 5.1,5.66 5.09,5.65
GPIO11/UART1_TX
  Top 0.152: J3.34 J1.2
GPIO19/CTP_RST
  Top 0.102: J1.5 19.7,6.26 | 19.69,6.26 5.1,6.26 J3.31
  Top 0.152: 19.7,6.26 19.69,6.26 | 5.1,6.26 20.3,6.26
GPIO25/CTP_EINT
  Top 0.102: J3.35 5.07,5.06 5.73,5.06 J1.1 | J1.1
  Top 0.152: 5.07,5.06 20.31,5.06
GPIO27/SPI_SCK
  Top 0.152: J3.4 J1.32
GPIO28/SPI_MOSI
  Top 0.152: J3.8 J1.28
GPIO29/SPI_MISO
  Top 0.102: J1.29 20.35,13.46 19.7,13.46 | 19.7,13.46 J3.7 | 1,13.46 J3.7 | J3.7
  Top 0.152: 19.7,13.46 | 20.35,13.46 5.09,13.46
GPIO30/EINT16
  Top 0.102: J1.11 19.7,8.06 | 19.7,8.06 5.11,8.06 1.16,8.06 | 1.16,8.06 1,8.06 | J3.25 1.15,8.06 1.16,8.06
  Top 0.152: 19.7,8.06 | 5.11,8.06 20.33,8.06
GPIO38/LSRSTB
  Top 0.152: J3.24 J1.12
GPIO39/LSCE_B
  Top 0.102: J1.13 20.34,8.66 19.7,8.66 | 19.7,8.66 1.16,8.66 | 1.16,8.66 1,8.66 | J3.23 1.15,8.66 1.16,8.66
  Top 0.152: 19.7,8.66 | 20.34,8.66 5.12,8.66
GPIO43/I2C_SCL
  Top 0.152: J3.30 J1.6
GPIO44/I2C_SDA
  Top 0.152: J1.4 J3.32
GPIO46/EAR_EINT
  Top 0.102: J3.1 5.85,15.26 | J1.35 20.33,15.26 19.7,15.26
  Top 0.152: 5.35,15.26 5.85,15.26 | 5.85,15.26 19.7,15.26 | 19.7,15.26 | 5.85,15.26 | 20.33,15.26 5.11,15.26
GPIO47/LSCK0
  Top 0.102: J1.17 20.34,9.86 19.7,9.86 1.16,9.86 | 1.16,9.86 1,9.86 | J3.19 1.16,9.86 | 1.16,9.86
  Top 0.152: 20.34,9.86 5.11,9.86 | 19.7,9.86
GPIO48/LSDA0
  Top 0.102: J3.21 5.1,9.26 5.73,9.26 | 5.73,9.26 19.71,9.26 J1.15
  Top 0.152: 5.73,9.26 | 19.71,9.26 5.74,9.26 5.73,9.27 | 5.1,9.26 20.32,9.26
GPIO49/LSA0
  Top 0.152: J3.22 J1.14
GPIO50/LPTE
  Top 0.152: J3.20 J1.16
MICBIAS0  (via drill 0.25 pad 0.51)
  Top 0.102: J1.22 v22.23,11.36 v22.24,11.37
  Top 0.152: R18.2 R21.2 v15.25,18.35 | J1.22 J3.14 | R2.1 v10.68,16.95
  Bottom 0.152: v22.24,11.37 22.24,15.11 19,18.35 v15.25,18.35 12.08,18.35 v10.68,16.95
N$1  (via drill 0.25 pad 0.51)
  Top 0.102: J3.13 3.28,11.66 v3.38,11.56
  Top 0.152: R1.1 v7,16.06
  Bottom 0.152: v3.38,11.56 7,15.18 v7,16.06
N$2
  Top 0.152: R2.2 R3.1
N$6
  Top 0.305: L4.1 C15.1 C4.1 C6.2
N$7
  Top 0.305: L8.1 C11.2 C3.2 C16.2 R18.1
N$8
  Top 0.305: R21.1 C12.1 C14.1 20.98,19.24 MIC.1
N$11
  Top 0.305: L4.2 C13.2 D5.1 19.5,16.06 MIC.4
N$51
  Top 0.305: L6.2 SPK.2
N$52
  Top 0.305: L7.2 SPK.1
SPK_OUT_N  (via drill 0.25 pad 0.51)
  Top 0.102: 5.22,12.86 | 5.22,12.86 20.34,12.86 J1.27 | 5.73,12.86 5.22,12.86 | 5.22,12.86 3.54,12.86 3.19,13.21 2.23,13.21 v1.82,12.8 1.76,12.86 J3.9 | J1.27 | 5.22,12.86
  Top 0.152: 20.34,12.86 5.12,12.86
  Top 0.305: v8.14,2.35 8.27,2.22 C1.2 9.79,2.22 C46.1 10.81,2.35 C47.2 11.56,2.22 D3.1 12.9,2.61 L6.1
  Bottom 0.305: v1.82,12.8 1.92,12.7 1.92,12.32 1.16,11.56 1.16,7.24 5.92,2.48 8.01,2.48 v8.14,2.35
SPK_OUT_P  (via drill 0.25 pad 0.51)
  Top 0.102: J3.10 2.82,12.56 v2.62,12.76
  Top 0.152: J1.26 J3.10
  Top 0.305: v8.14,3.11 8.27,3.24 C48.2 C46.2 C2.2 11.7,3.24 D4.1 12.9,3.49 L7.1
  Bottom 0.305: v2.62,12.76 2.43,12.57 2.43,12.19 1.66,11.43 1.66,7.49 5.51,3.65 5.6,3.56 6.17,2.98 8.01,2.98 v8.14,3.11
VBAT
  Top 0.102: J3.28 2.76,7.16 2.46,7.46 J3.27 | J1.9 22.84,7.46 22.54,7.16 J1.8
  Top 0.152: J1.8 J3.28
VIO28_LDO
  Top 0.102: J3.29 5.73,6.86 | 5.73,6.86 20.33,6.86 J1.7
  Top 0.152: 5.73,6.86 | 20.33,6.86 5.09,6.86

### Text on the board
bPlace: Xadow Audio | v1.0 09/23/2015 | by Seeed Studio | www.seeedstudio.com